# EAGLE schematic atmega_simon_says (EAGLE 6.5.0)
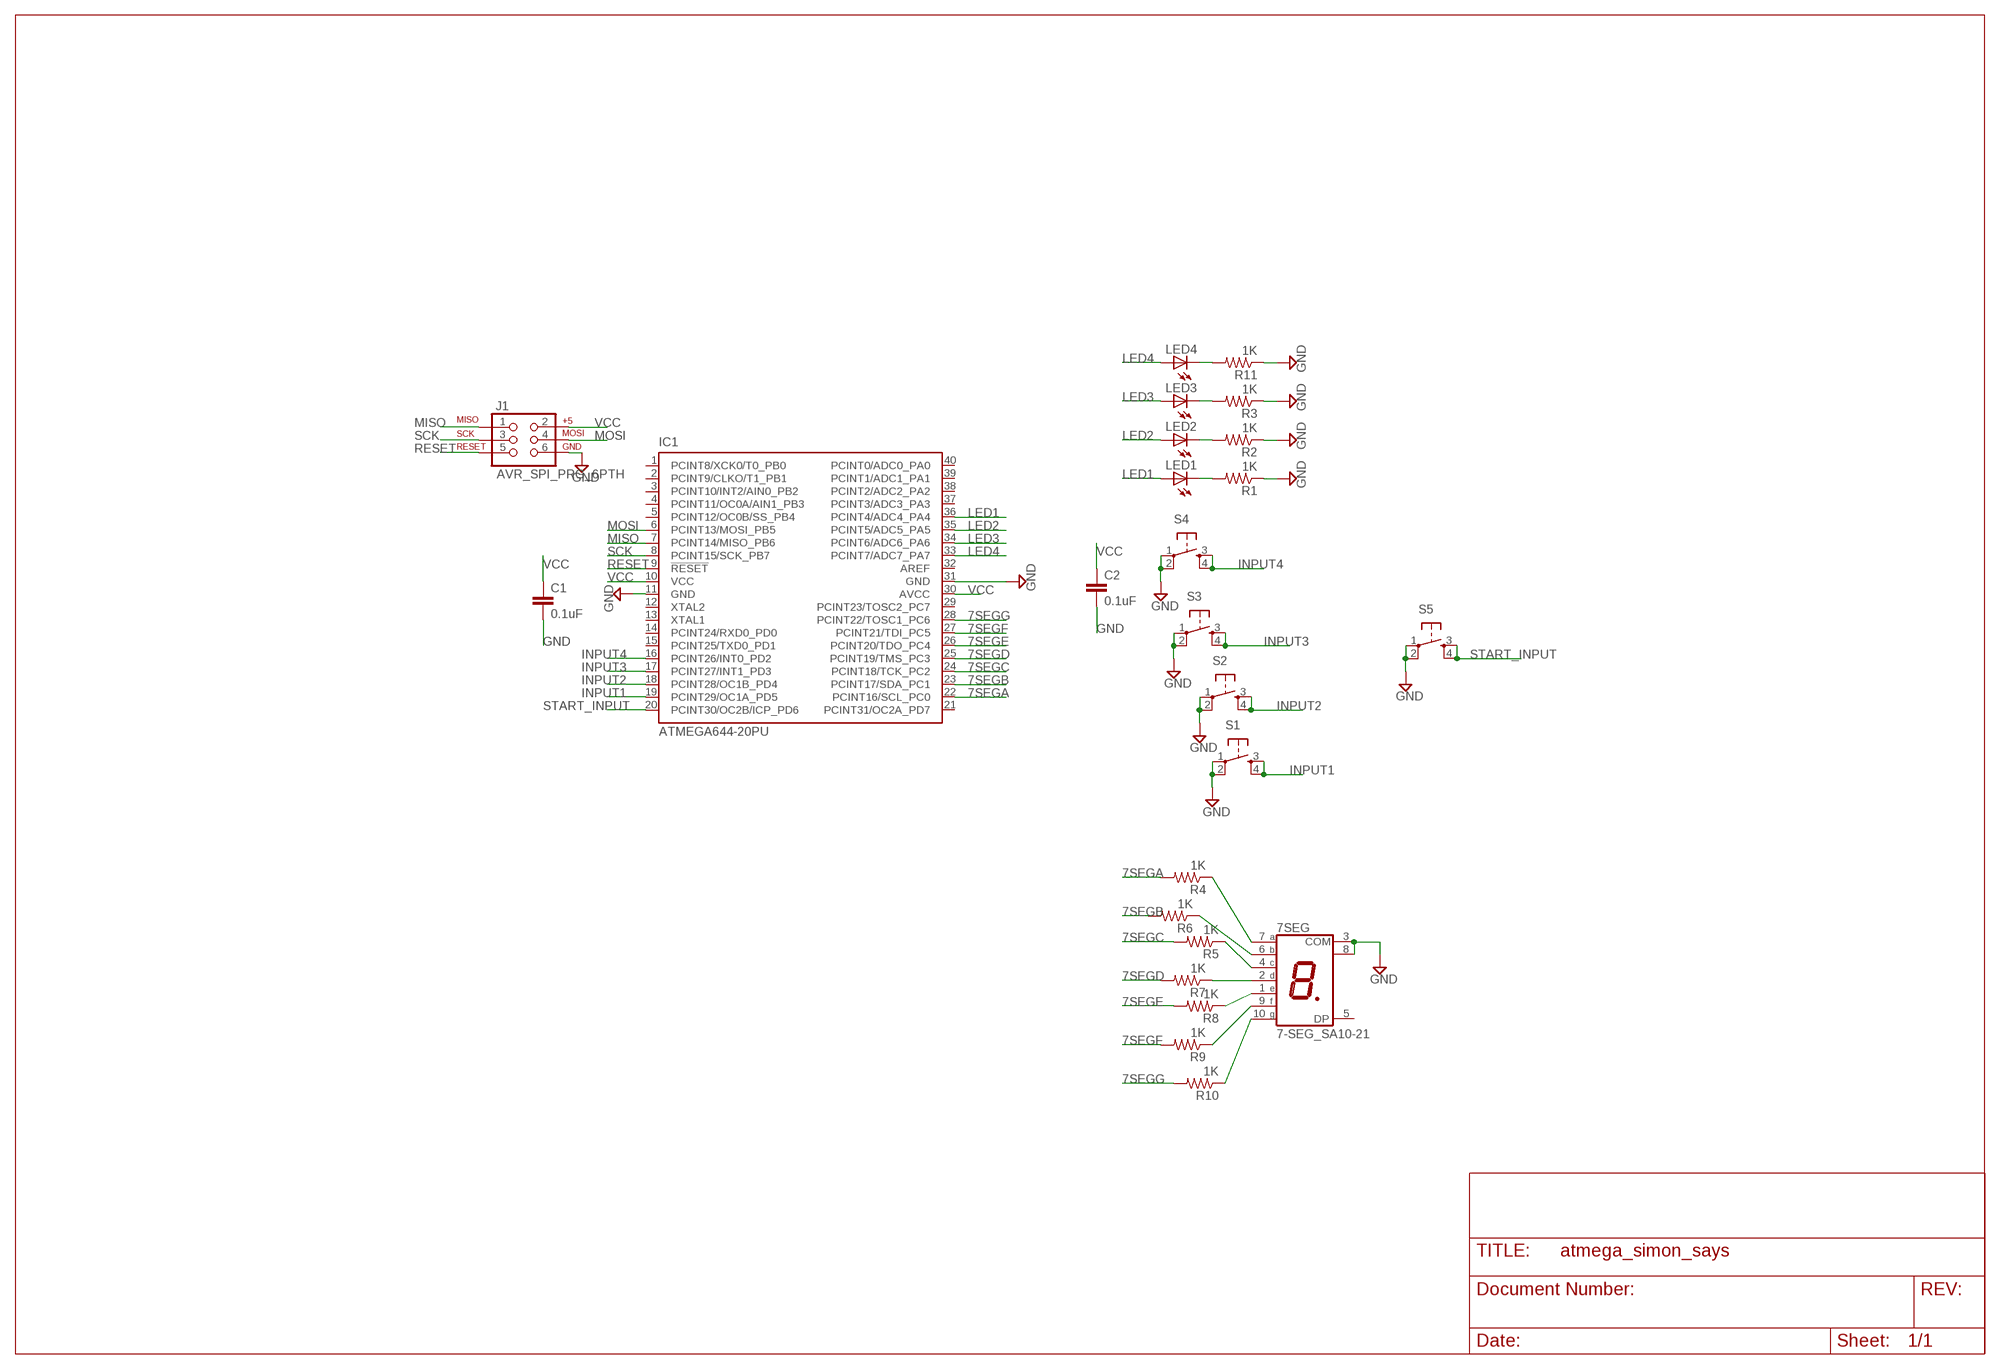
[diagram p0: schematic, sheet 1]

## Parts
7SEG  7-SEG_SA10-21  [SA10-21]
C1  0.1uF  0.1UF-25V(+80/-20%)(0603)  [0603-CAP]
C2  0.1uF  0.1UF-25V(+80/-20%)(0603)  [0603-CAP]
IC1  ATMEGA644-20PU  [DIL40]
J1  AVR_SPI_PRG_6PTH  [2X3]
LED1  LED3MM  [LED3MM]
LED2  LED3MM  [LED3MM]
LED3  LED3MM  [LED3MM]
LED4  LED3MM  [LED3MM]
R1  1K  R-US_0204/5  [0204/5]
R2  1K  R-US_0204/5  [0204/5]
R3  1K  R-US_0204/5  [0204/5]
R4  1K  R-US_0204/5  [0204/5]
R5  1K  R-US_0204/5  [0204/5]
R6  1K  R-US_0204/5  [0204/5]
R7  1K  R-US_0204/5  [0204/5]
R8  1K  R-US_0204/5  [0204/5]
R9  1K  R-US_0204/5  [0204/5]
R10  1K  R-US_0204/5  [0204/5]
R11  1K  R-US_0204/5  [0204/5]
S1  TAC_SWITCHPTH  [TACTILE-PTH]
S2  TAC_SWITCHPTH  [TACTILE-PTH]
S3  TAC_SWITCHPTH  [TACTILE-PTH]
S4  TAC_SWITCHPTH  [TACTILE-PTH]
S5  TAC_SWITCHPTH  [TACTILE-PTH]

## Nets
7SEGA: IC1.22(PCINT16/SCL_PC0) R4.2
7SEGB: IC1.23(PCINT17/SDA_PC1) R6.2
7SEGC: IC1.24(PCINT18/TCK_PC2) R5.2
7SEGD: IC1.25(PCINT19/TMS_PC3) R7.2
7SEGE: IC1.26(PCINT20/TDO_PC4) R8.2
7SEGF: IC1.27(PCINT21/TDI_PC5) R9.2
7SEGG: IC1.28(PCINT22/TOSC1_PC6) R10.2
GND: 7SEG.3(COM) 7SEG.8(COM) C1.2 C2.2 IC1.11(GND) IC1.31(GND) J1.6 R1.1 R2.1 R3.1 R11.1 S1.1 S1.2 S2.1 S2.2 S3.1 S3.2 S4.1 S4.2 S5.1 S5.2
INPUT1: IC1.19(PCINT29/OC1A_PD5) S1.3 S1.4
INPUT2: IC1.18(PCINT28/OC1B_PD4) S2.3 S2.4
INPUT3: IC1.17(PCINT27/INT1_PD3) S3.3 S3.4
INPUT4: IC1.16(PCINT26/INT0_PD2) S4.3 S4.4
LED1: IC1.36(PCINT4/ADC4_PA4) LED1.A
LED2: IC1.35(PCINT5/ADC5_PA5) LED2.A
LED3: IC1.34(PCINT6/ADC6_PA6) LED3.A
LED4: IC1.33(PCINT7/ADC7_PA7) LED4.A
MISO: IC1.7(PCINT14/MISO_PB6) J1.1
MOSI: IC1.6(PCINT13/MOSI_PB5) J1.4
N$1: LED1.K(C) R1.2
N$2: LED2.K(C) R2.2
N$3: LED3.K(C) R3.2
N$5: 7SEG.7(A) R4.1
N$6: 7SEG.4(C) R5.1
N$7: 7SEG.6(B) R6.1
N$8: 7SEG.2(D) R7.1
N$9: 7SEG.1(E) R8.1
N$10: 7SEG.9(F) R9.1
N$11: 7SEG.10(G) R10.1
N$12: LED4.K(C) R11.2
RESET: IC1.9(!RESET) J1.5
SCK: IC1.8(PCINT15/SCK_PB7) J1.3
START_INPUT: IC1.20(PCINT30/OC2B/ICP_PD6) S5.3 S5.4
VCC: C1.1 C2.1 IC1.10(VCC) IC1.30(AVCC) J1.2
Unconnected: 7SEG.5(DP) IC1.1(PCINT8/XCK0/T0_PB0) IC1.2(PCINT9/CLKO/T1_PB1) IC1.3(PCINT10/INT2/AIN0_PB2) IC1.4(PCINT11/OC0A/AIN1_PB3) IC1.5(PCINT12/OC0B/SS_PB4) IC1.12(XTAL2) IC1.13(XTAL1) IC1.14(PCINT24/RXD0_PD0) IC1.15(PCINT25/TXD0_PD1) IC1.21(PCINT31/OC2A_PD7) IC1.29(PCINT23/TOSC2_PC7) IC1.32(AREF) IC1.37(PCINT3/ADC3_PA3) IC1.38(PCINT2/ADC2_PA2) IC1.39(PCINT1/ADC1_PA1) IC1.40(PCINT0/ADC0_PA0)

## Library data of the parts
7SEG = display-kingbright:7-SEG_: Kingbright 14.2mm (0.56 INCH) SINGLE DIGIT NUMERIC DUISPLAY Source: SA56-11EWA(Ver1189471036.pdf; OC_FARNELL: unknown; OC_NEWARK: unknown
C1 C2 = SparkFun-Capacitors:0.1UF-25V(+80/-20%)(0603): Ceramic Standard decoupling cap CAP-00810; PROD_ID: CAP-00810
IC1 = atmel:ATMEGA644-*PU: 8-bit Microcontroller with 64K Bytes In-System Programmable Flash Auto generated by make-symbol-device-package-bsdl.ulp Rev. 34 Source: http://www.atmel.com/dyn/resources/prod_documents/doc2593.pdf; MPN: ATMEGA644-20PU; OC_FARNELL: 1288340; OC_NEWARK: 23M5060
J1 = SparkFun-Connectors:AVR_SPI_PRG_6: AVR ISP 6 Pin This is the reduced ISP connector for AVR programming. Common on Arduino. This footprint will take up less PCB space and can be used with a 10-pin to 6-pin adapter such as SKU: BOB-08508
LED1-LED4 = SparkFun-LED:LED: LEDs Standard schematic elements and footprints for 5mm, 3mm, 1206, and 0603 sized LEDs. 5mm - Spark Fun Electronics SKU : COM-00529 (and others)
R1-R11 = resistor:R-US_: RESISTOR, American symbol
S1-S5 = SparkFun-Electromechanical:TAC_SWITCH: Momentary Switch Button commonly used for reset or general input. Spark Fun Electronics SKU : COM-00097 SMT- SWCH-08247